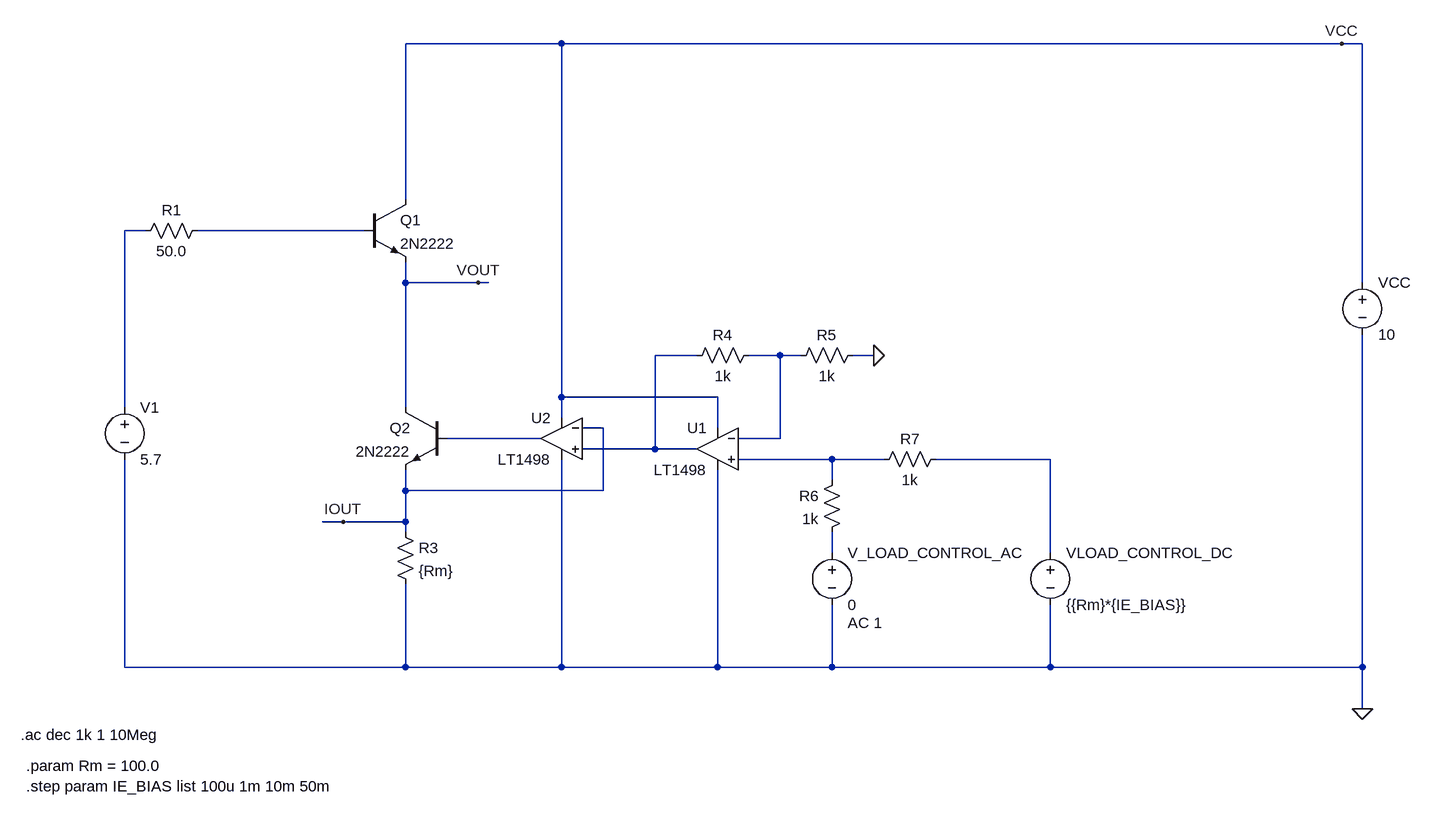
[diagram p0: schematic Emitter_Follower_Output_Impedance_Measurement.asc]
Emitter_Follower_Output_Impedance_Measurement.asc, the LTspice schematic file:
Version 4.1
SHEET 1 988 772
WIRE -432 -384 -672 -384
WIRE 768 -384 -432 -384
WIRE 800 -384 768 -384
WIRE -672 -144 -672 -384
WIRE -1072 -96 -1104 -96
WIRE -736 -96 -992 -96
WIRE -672 -16 -672 -48
WIRE -560 -16 -672 -16
WIRE -544 -16 -560 -16
WIRE 800 -16 800 -384
WIRE -224 96 -288 96
WIRE -96 96 -144 96
WIRE -64 96 -96 96
WIRE 48 96 16 96
WIRE -432 160 -432 -384
WIRE -192 160 -432 160
WIRE -1104 176 -1104 -96
WIRE -672 176 -672 -16
WIRE -432 192 -432 160
WIRE -368 208 -400 208
WIRE -192 208 -192 160
WIRE -464 224 -608 224
WIRE -96 224 -96 96
WIRE -96 224 -160 224
WIRE -288 240 -288 96
WIRE -288 240 -400 240
WIRE -224 240 -288 240
WIRE -16 256 -160 256
WIRE 64 256 -16 256
WIRE 320 256 144 256
WIRE -16 288 -16 256
WIRE -672 304 -672 272
WIRE -368 304 -368 208
WIRE -368 304 -672 304
WIRE -768 352 -800 352
WIRE -672 352 -672 304
WIRE -672 352 -768 352
WIRE -672 368 -672 352
WIRE -16 400 -16 368
WIRE 320 400 320 256
WIRE -1104 576 -1104 256
WIRE -672 576 -672 448
WIRE -672 576 -1104 576
WIRE -432 576 -432 256
WIRE -432 576 -672 576
WIRE -192 576 -192 272
WIRE -192 576 -432 576
WIRE -16 576 -16 480
WIRE -16 576 -192 576
WIRE 320 576 320 480
WIRE 320 576 -16 576
WIRE 800 576 800 64
WIRE 800 576 320 576
WIRE 800 640 800 576
FLAG 800 640 0
FLAG 768 -384 VCC
FLAG -560 -16 VOUT
FLAG -768 352 IOUT
FLAG 48 96 0
SYMBOL npn -736 -144 R0
SYMATTR InstName Q1
SYMATTR Value 2N2222
SYMBOL voltage 800 -32 R0
WINDOW 123 0 0 Left 0
WINDOW 39 0 0 Left 0
SYMATTR InstName VCC
SYMATTR Value 10
SYMBOL npn -608 176 M0
SYMATTR InstName Q2
SYMATTR Value 2N2222
SYMBOL res -688 352 R0
SYMATTR InstName R3
SYMATTR Value {Rm}
SYMBOL res -240 112 R270
WINDOW 0 32 56 VTop 2
WINDOW 3 0 56 VBottom 2
SYMATTR InstName R4
SYMATTR Value 1k
SYMBOL res -80 112 R270
WINDOW 0 32 56 VTop 2
WINDOW 3 0 56 VBottom 2
SYMATTR InstName R5
SYMATTR Value 1k
SYMBOL res 0 272 M0
SYMATTR InstName R6
SYMATTR Value 1k
SYMBOL res 48 272 R270
WINDOW 0 32 56 VTop 2
WINDOW 3 0 56 VBottom 2
SYMATTR InstName R7
SYMATTR Value 1k
SYMBOL voltage 320 384 R0
WINDOW 123 0 0 Left 0
WINDOW 39 0 0 Left 0
SYMATTR InstName VLOAD_CONTROL_DC
SYMATTR Value {{Rm}*{IE_BIAS}}
SYMBOL voltage -16 384 R0
WINDOW 123 24 124 Left 2
WINDOW 39 0 0 Left 0
SYMATTR InstName V_LOAD_CONTROL_AC
SYMATTR Value 0
SYMATTR Value2 AC 1
SYMBOL OpAmps\\LT1498 -192 176 M0
SYMATTR InstName U1
SYMBOL OpAmps\\LT1498 -432 160 M0
SYMATTR InstName U2
SYMBOL voltage -1104 160 R0
WINDOW 123 0 0 Left 0
WINDOW 39 0 0 Left 0
SYMATTR InstName V1
SYMATTR Value 5.7
SYMBOL res -1088 -80 R270
WINDOW 0 32 56 VTop 2
WINDOW 3 0 56 VBottom 2
SYMATTR InstName R1
SYMATTR Value 50.0
TEXT -1264 680 Left 2 !.ac dec 1k 1 10Meg
TEXT -1256 728 Left 2 !.param Rm = 100.0\n.step param IE_BIAS list 100u 1m 10m 50m

The netlist it stands for:
* Emitter_Follower_Output_Impedance_Measurement.asc
Q1 VCC N002 VOUT 0 2N2222
VCC VCC 0 10
Q2 VOUT N005 IOUT 0 2N2222
R3 IOUT 0 {Rm}
R4 N003 N004 1k
R5 N004 0 1k
R6 N006 N008 1k
R7 N006 N007 1k
VLOAD_CONTROL_DC N007 0 {{Rm}*{IE_BIAS}}
V_LOAD_CONTROL_AC N008 0 0 AC 1
X§U1 N006 N004 VCC 0 N003 LT1498  ; pins In+ In- V+ V- OUT
X§U2 N003 IOUT VCC 0 N005 LT1498  ; pins In+ In- V+ V- OUT
V1 N001 0 5.7
R1 N001 N002 50.0
.model NPN NPN
.model PNP PNP
.lib standard.bjt
.ac dec 1k 1 10Meg
.param Rm = 100.0
.step param IE_BIAS list 100u 1m 10m 50m
.lib LTC.lib
.backanno
.end